# Altium project FluidGuard(Rx).PrjPcb (part 2 of 3)

## Sheet PowerSwitch.SchDoc: POWER BLOCK
size A4; SheetNumber: 5; SheetTotal: 7; DOC_NO_SCH_DWG: #022024031504
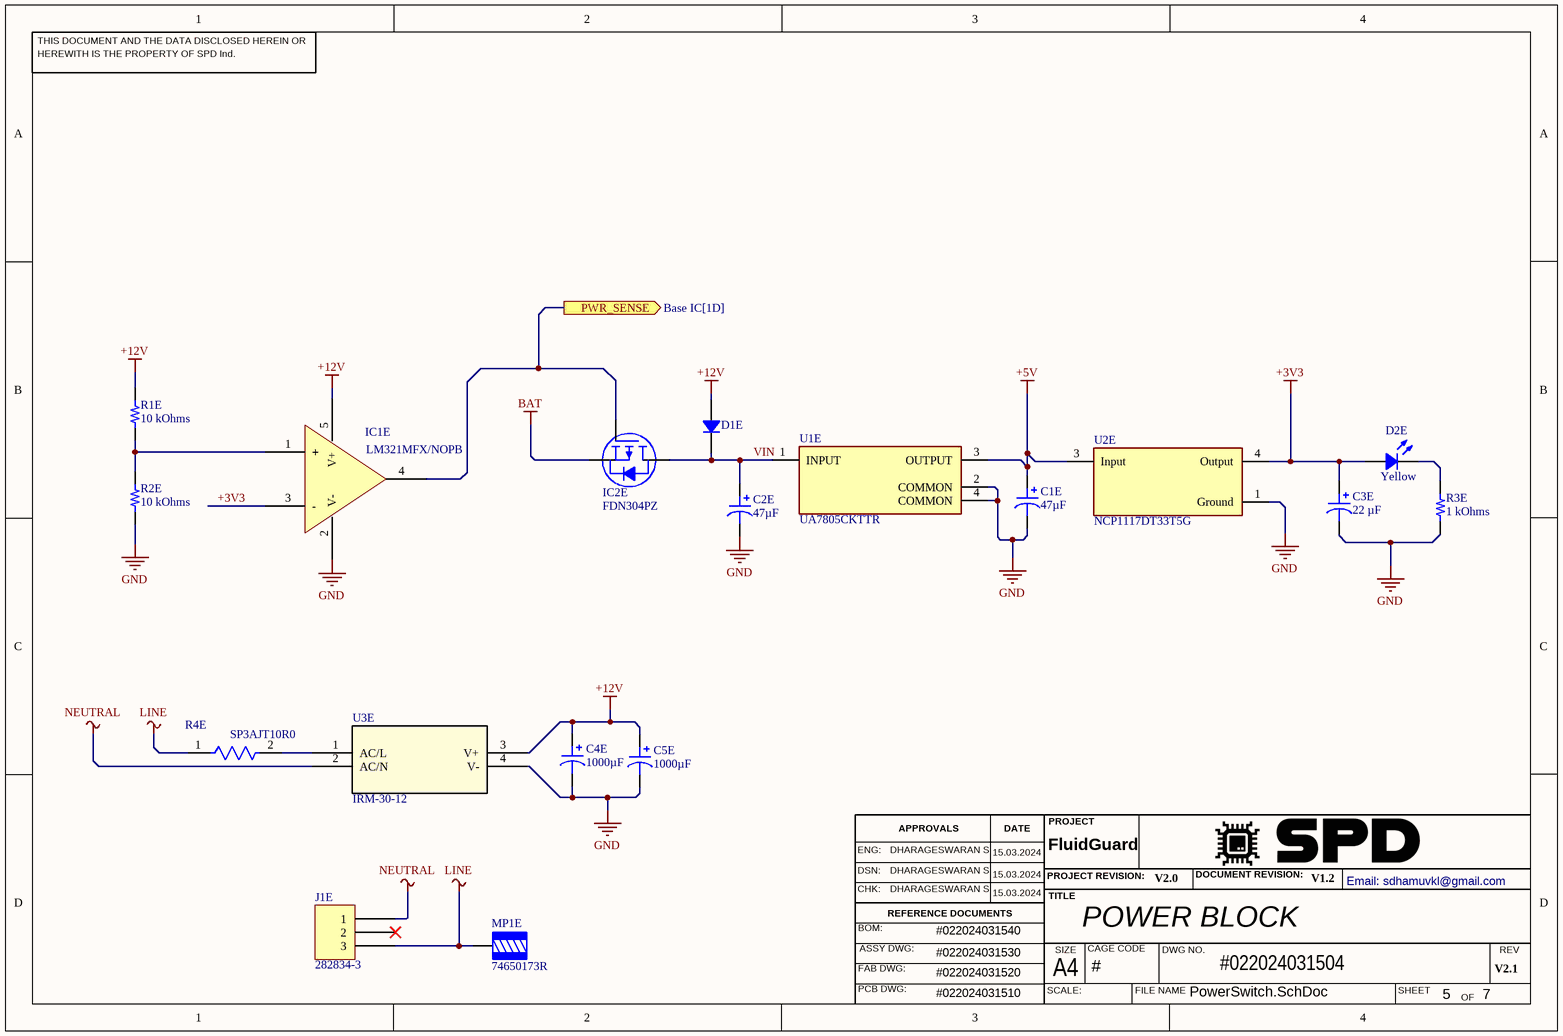
[diagram p3: PowerSwitch.SchDoc]

### Parts
C1E  47µF  [CAP ALSMD 6.6MM H5.4MM]
C2E  47µF  [CAP ALSMD 6.6MM H5.4MM]
C3E  22 µF  [CAP POL 2917_7343]
C4E  1000µF  [CAP TH ALUM ELEC D10.00mm S5.00mm H14.00mm]
C5E  1000µF  [CAP TH ALUM ELEC D10.00mm S5.00mm H14.00mm]
D1E  ES2A-13-F  [DO214AA SMB]  (value not drawn)
D2E  Yellow  [LED 0402_1005 YELLOW]
IC1E  LM321MFX/NOPB  [TI SOT-23-5 DBV]
IC2E  FDN304PZ  [ON SEMI SOT-23-3]
J1E  282834-3  [TE 282834-3]
MP1E  74650173R  [WURTH 74650173]
R1E  10 kOhms  [RES 0402_1005]
R2E  10 kOhms  [RES 0402_1005]
R3E  1 kOhms  [RES 0402_1005]
R4E  SP3AJT10R0  [FP-SP3A-MFG]
U1E  UA7805CKTTR  [FP-KTT0003A-MFG]
U2E  NCP1117DT33T5G  [FP-369C-MFG]
U3E  IRM-30-12  [IRM-30_MWU]

### Ports
PWR_SENSE (out, see Base IC[1D])

### Nets
+3V3: C3E.1 D2E.1 IC1E.3(-) U2E.4(Output)
+5V: C1E.1 U1E.3(OUTPUT) U2E.3(Input)
+12V: C4E.1 C5E.1 D1E.1 IC1E.5(V+) R1E.2 U3E.3(V+)
BAT: IC2E.2(S)
GND: C1E.2 C2E.2 C3E.2 C4E.2 C5E.2 IC1E.2(V-) R2E.1 R3E.1 U1E.2(COMMON) U1E.4(COMMON) U2E.1(Ground) U3E.4(V-)
LINE: J1E.3 MP1E.1 R4E.1
NEUTRAL: J1E.1 U3E.2(AC/N)
VIN: C2E.1 D1E.2 IC2E.3(D) U1E.1(INPUT)
NetD2E_2: D2E.2 R3E.2
NetIC1E_1: IC1E.1(+) R1E.1 R2E.2
NetIC1E_4: IC1E.4(OUT) IC2E.1(G) ; port PWR_SENSE
NetR4E_2: R4E.2 U3E.1(AC/L)

Not connected (* = marked no-connect by the designer): J1E 2*

### Notes on the sheet
- THIS DOCUMENT AND THE DATA DISCLOSED HEREIN OR
- HEREWITH IS THE PROPERTY OF SPD Ind.
- ENG:
- DHARAGESWARAN S
- APPROVALS
- DATE
- PROJECT
- DSN:
- CHK:
- REFERENCE DOCUMENTS
- PROJECT REVISION:
- TITLE
- DOCUMENT REVISION:
- Email: sdhamuvkl@gmail.com <https://github.com/DhamuVkl>
- BOM:
- FAB DWG:
- PCB DWG:
- ASSY DWG:
- SCALE:
- A4
- SIZE
- CAGE CODE
- FILE NAME
- DWG NO.
- SHEET
- REV
- OF

### Library data of the parts
C1E C2E = EEE-HA1C470P: CAP ALUM 47UF 20% 16V SMD; Manufacturer: Panasonic Electronic Components; id: 1065; Ripple Current @ Low Frequency: 70mA @ 120Hz; Surface Mount Land Size: 0.260" L x 0.260" W (6.60mm x 6.60mm); Polarization: Polar; Lifetime @ Temp.: 1000 Hrs @ 105°C; Ripple Current @ High Frequency: 119mA @ 10kHz; Part Number: EEE-HA1C470P; Value: 47µF; Height - Seated (Max): 0.213" (5.40mm); Supplier Part Number 1: PCE4189CT-ND; ComponentLink2Description: DigiKey Link; ComponentLink1URL: https://industrial.panasonic.com/cdbs/www-data/pdf/RDE0000/ABA0000C1151.pdf; PartId: 8737; Tolerance: ±20%; Supplier 1: DigiKey; Series: HA; LastUpdated: 2020-09-02T01:18:32.593; Part Status: Active; Capacitance: 47µF; Device Package: Radial, Can - SMD; Ratings: AEC-Q200; Voltage - Rated: 16V; Minimum Order: 1; Packaging: TapeAndReel; Applications: Automotive; Package / Case: Radial, Can - SMD; ComponentLink1Description: Datasheet; Price: 0.08; ComponentLink2URL: http://digikey.com/product-detail/en/panasonic-electronic-components/EEE-HA1C470P/PCE4189CT-ND/814262; Lifecycle Status: Active; Operating Temperature: -40°C ~ 105°C; Size / Dimension: 0.248" Dia (6.30mm); Mounting Type: Surface Mount
C3E = T491D226K010AT: CAP TANT 22UF 10% 10V 2917; Manufacturer: KEMET; Manufacturer Size Code: D; id: 3007; Type: Molded; Lifetime @ Temp.: 2000 Hrs @ 125°C; Esr (Equivalent Series Resistance): 1.6Ohm; Part Number: T491D226K010AT; Value: 22 µF; Height - Seated (Max): 0.122" (3.10mm); Supplier Part Number 1: 399-5599-1-ND; ComponentLink2Description: DigiKey Link; Features: General Purpose; ComponentLink1URL: https://api.kemet.com/component-edge/download/datasheet/T491D226K010AT.pdf; PartId: 3007; Tolerance: ±10%; Supplier 1: DigiKey; Series: T491; LastUpdated: 2023-01-02T20:46:27.020; Part Status: Active; Capacitance: 22 µF; Device Package: 2917 (7343 Metric); Voltage - Rated: 10 V; Minimum Order: 1; Packaging: TapeAndReel; Package / Case: 2917 (7343 Metric); ComponentLink1Description: Datasheet; Price: 0.31; ComponentLink2URL: https://www.digikey.com/en/products/detail/kemet/T491D226K010AT/2039625; Lifecycle Status: Active; Operating Temperature: -55°C ~ 125°C; Size / Dimension: 0.287" L x 0.169" W (7.30mm x 4.30mm); Mounting Type: Surface Mount
C4E C5E = 860020375017: CAP ALUM 1000UF 20% 16V RADIAL; Manufacturer: Würth Elektronik; id: 1938; Ripple Current @ Low Frequency: 540mA @ 120Hz; Polarization: Polar; Lifetime @ Temp.: 2000 Hrs @ 105°C; Ripple Current @ High Frequency: 745.2mA @ 100kHz; Part Number: 860020375017; Value: 1000µF; Height - Seated (Max): 0.551" (14.00mm); Supplier Part Number 1: 732-8804-1-ND; ComponentLink2Description: DigiKey Link; ComponentLink1URL: https://katalog.we-online.de/pbs/datasheet/860020375017.pdf; PartId: 11161; Tolerance: ±20%; Supplier 1: DigiKey; Series: WCAP-ATG5; LastUpdated: 2020-09-02T01:31:11.520; Part Status: Active; Capacitance: 1000µF; Device Package: Radial, Can; Voltage - Rated: 16V; Lead Spacing: 0.197" (5.00mm); Minimum Order: 1; Packaging: TapeAndBox; Applications: General Purpose; Package / Case: Radial, Can; ComponentLink1Description: Datasheet; Price: 0.24; ComponentLink2URL: http://digikey.com/product-detail/en/w-rth-elektronik/860020375017/732-8804-1-ND/5728749; Lifecycle Status: Active; Operating Temperature: -40°C ~ 105°C; Size / Dimension: 0.394" Dia (10.00mm); Mounting Type: Through Hole
D1E = ES2A-13-F: DIODE GEN PURP 50V 2A SMB; Manufacturer: Diodes Incorporated; id: 319; Reverse Recovery Time (Trr): 25 ns; Capacitance @ Vr, F: 25pF @ 4V, 1MHz; Speed: Fast Recovery =< 500ns, > 200mA (Io); Voltage - Forward (Vf) (Max) @ If: 920 mV @ 2 A; Diode Type: Standard; Current - Reverse Leakage @ Vr: 5 µA @ 50 V; Part Number: ES2A-13-F; Supplier Part Number 1: ES2A-FDICT-ND; Supplier Device Package: SMB; ComponentLink1Description: Datasheet; ComponentLink2URL: https://www.digikey.com/en/products/detail/diodes-incorporated/ES2A-13-F/815105; ComponentLink1URL: https://www.diodes.com/assets/Datasheets/ds14002.pdf; Supplier 1: DigiKey; Series: -; Part Status: Active; ComponentLink2Description: DigiKey Link; Current - Average Rectified (Io): 2A; Operating Temperature - Junction: -55°C ~ 150°C; Packaging: TapeAndReel; Minimum Order: 1; Voltage - DC Reverse (Vr) (Max): 50 V; Package / Case: DO-214AA, SMB; PartId: 319; Lifecycle Status: Active; LastUpdated: 2023-01-02T20:53:06.797; Mounting Type: Surface Mount; Price: 0.22
D2E = SM0402YC: LED YELLOW CLEAR 0402 SMD; Manufacturer: Bivar Inc.; id: 170; Lens Color: Colorless; Wavelength - Peak: 593nm; Lens Style: Rectangle with Flat Top; Viewing Angle: 130°; Lens Size: 0.50mm x 1.00mm; Configuration: 0402; Wavelength - Dominant: 592nm; Voltage - Forward (Vf) (Typ): 2V; Current - Test: 20mA; Millicandela Rating: 145mcd; Part Number: SM0402YC; Supplier Part Number 1: 492-2206-1-ND; Lens Transparency: Clear; Supplier Device Package: 0402; ComponentLink1Description: Datasheet; Color: Yellow; ComponentLink2URL: https://www.digikey.com/en/products/detail/bivar-inc/SM0402YC/6810862; ComponentLink1URL: https://www.bivar.com/Files/Datasheets/SM0402YC.pdf; Supplier 1: DigiKey; Series: -; Height (Max): 0.71mm; Part Status: Active; ComponentLink2Description: DigiKey Link; Device Package: 0402 (1005 Metric); Packaging: TapeAndReel; Minimum Order: 1; Package / Case: 0402 (1005 Metric); PartId: 170; Lifecycle Status: Active; LastUpdated: 2023-01-02T20:57:30.187; Value: Yellow; Size / Dimension: 1.00mm L x 0.50mm W; Mounting Type: Surface Mount; Price: 0.16
IC1E = LM321MFX/NOPB: IC OPAMP GP 1 CIRCUIT SOT23-5; Manufacturer: Texas Instruments; id: 11; Voltage - Input Offset: 2mV; Slew Rate: 0.4V/µs; Number Of Circuits: 1; Current - Input Bias: 45nA; Gain Bandwidth Product: 1MHz; Amplifier Type: General Purpose; Current - Supply: 660µA; Voltage - Supply, Single/Dual (±): 3V ~ 30V, ±1.5V ~ 15V; Current - Output / Channel: 40mA; Part Number: LM321MFX/NOPB; Supplier Part Number 1: LM321MFX/NOPBCT-ND; Supplier Device Package: SOT-23-5; ComponentLink1Description: Datasheet; ComponentLink2URL: http://digikey.com/product-detail/en/texas-instruments/LM321MFX-NOPB/LM321MFX-NOPBCT-ND/3440175; ComponentLink1URL: http://www.ti.com/general/docs/suppproductinfo.tsp?distId=10&gotoUrl=http%3A%2F%2Fwww.ti.com%2Flit%2Fgpn%2Flm321; Supplier 1: DigiKey; Series: -; Part Status: Active; ComponentLink2Description: DigiKey Link; Device Package: SC-74A, SOT-753; Packaging: TapeAndReel; Minimum Order: 1; Package / Case: SC-74A, SOT-753; PartId: 11; Lifecycle Status: Active; LastUpdated: 2020-03-30T15:10:58.873; Operating Temperature: -40°C ~ 85°C; Mounting Type: Surface Mount; Price: 0.23
IC2E = FDN304PZ: MOSFET P-CH 20V 2.4A SSOT-3; Manufacturer: ON Semiconductor; id: 80; FET Type: P-Channel; Drive Voltage (Max Rds On,  Min Rds On): 1.8V, 4.5V; Power Dissipation (Max): 500mW (Ta); Vgs (Max): ±8V; Input Capacitance (Ciss) (Max) @ Vds: 1310pF @ 10V; Gate Charge (Qg) (Max) @ Vgs: 20nC @ 4.5V; Current - Continuous Drain (Id) @ 25°C: 2.4A (Ta); Rds On (Max) @ Id, Vgs: 52mOhm @ 2.4A, 4.5V; Vgs(Th) (Max) @ Id: 1.5V @ 250µA; Part Number: FDN304PZ; Supplier Part Number 1: FDN304PZCT-ND; Supplier Device Package: SuperSOT-3; ComponentLink1Description: Datasheet; ComponentLink2URL: http://digikey.com/product-detail/en/on-semiconductor/FDN304PZ/FDN304PZCT-ND/1849909; ComponentLink1URL: https://www.onsemi.com/pub/Collateral/FDN304PZ-D.pdf; Supplier 1: DigiKey; Series: PowerTrench®; Part Status: Active; ComponentLink2Description: DigiKey Link; Packaging: TapeAndReel; Minimum Order: 1; Drain To Source Voltage (Vdss): 20V; Package / Case: TO-236-3, SC-59, SOT-23-3; Lifecycle Status: Active; LastUpdated: 2023-01-02T21:05:00.863; Technology: MOSFET (Metal Oxide); Operating Temperature: -55°C ~ 150°C (TJ); Mounting Type: Surface Mount; Price: 0.18
J1E = 282834-3: TERM BLK 3P SIDE ENT 2.54MM PCB; Manufacturer: TE Connectivity AMP Connectors; id: 2; Wire Gauge: 16-30 AWG; Voltage: 150V; Positions Per Level: 3; Number Of Levels: 1; Pitch: 0.100" (2.54mm); Mating Orientation: Horizontal with Board; Wire Termination: Screw - Rising Cage Clamp; Current: 10A; Part Number: 282834-3; Supplier Part Number 1: A98334-ND; ComponentLink1Description: Datasheet; Color: Green; ComponentLink2URL: http://digikey.com/product-detail/en/te-connectivity-amp-connectors/282834-3/A98334-ND/1153264; ComponentLink1URL: https://www.te.com/commerce/DocumentDelivery/DDEController?Action=srchrtrv&DocNm=282834&DocType=Customer+Drawing&DocLang=English; Supplier 1: DigiKey; Series: Buchanan; Part Status: Active; ComponentLink2Description: DigiKey Link; Packaging: Bulk; Minimum Order: 1; Lifecycle Status: Active; LastUpdated: 2020-01-15T04:15:50.317; Mounting Type: Through Hole; Price: 2.01
MP1E = 74650173R: TERM REDCUBE M3 4PIN PCB; Manufacturer: Würth Elektronik; id: 4; Current Rating (Amps): 50 A; Part Number: 74650173R; Supplier Part Number 1: 732-10885-1-ND; Termination: Solder; Screw Size: M3; ComponentLink1Description: Datasheet; ComponentLink2URL: https://www.digikey.com/en/products/detail/würth-elektronik/74650173R/6643981; Features: Screw not Included; ComponentLink1URL: https://katalog.we-online.de/em/datasheet/74650173R.pdf; Supplier 1: DigiKey; Series: REDCUBE WP-THRBU; Part Status: Active; ComponentLink2Description: DigiKey Link; Number Of Pins: 4; Packaging: TapeAndReel; Minimum Order: 1; Lifecycle Status: Active; LastUpdated: 2022-08-07T20:42:53.530; Terminal Type: Screw Terminal, Power Tap; Mounting Type: Through Hole; Price: 2.63
R1E R2E = AA0402FR-0710KL: RES SMD 10K OHM 1% 1/16W 0402; Manufacturer: Yageo; id: 10610; Temperature Coefficient: ±150ppm/°C; Power (Watts): 0.063W, 1/16W; Part Number: AA0402FR-0710KL; Height - Seated (Max): 0.015" (0.37mm); Supplier Part Number 1: 13-AA0402FR-0710KLCT-ND; Supplier Device Package: 0402; ComponentLink1Description: Datasheet; ComponentLink2URL: https://www.digikey.com/en/products/detail/yageo/AA0402FR-0710KL/5887729; Features: Anti-Sulfur, Automotive AEC-Q200, Moisture Resistant; ComponentLink1URL: https://www.yageo.com/upload/media/product/productsearch/datasheet/rchip/PYu-AA_51_RoHS_L_3.pdf; Composition: Thick Film; Tolerance: ±1%; Supplier 1: DigiKey; Series: AA; Part Status: Active; ComponentLink2Description: DigiKey Link; Device Package: 0402 (1005 Metric); Packaging: TapeAndReel; Ratings: AEC-Q200; Minimum Order: 1; Package / Case: 0402 (1005 Metric); PartId: 59190; Lifecycle Status: Active; LastUpdated: 2023-01-02T20:20:10.303; Operating Temperature: -55°C ~ 155°C; Number Of Terminations: 2; Value: 10 kOhms; Size / Dimension: 0.039" L x 0.020" W (1.00mm x 0.50mm); Price: 0.01; Resistance: 10 kOhms
R3E = AA0402FR-071KL: RES SMD 1K OHM 1% 1/16W 0402; Manufacturer: Yageo; id: 10598; Temperature Coefficient: ±150ppm/°C; Power (Watts): 0.063W, 1/16W; Part Number: AA0402FR-071KL; Height - Seated (Max): 0.015" (0.37mm); Supplier Part Number 1: 13-AA0402FR-071KLCT-ND; Supplier Device Package: 0402; ComponentLink1Description: Datasheet; ComponentLink2URL: https://www.digikey.com/en/products/detail/yageo/AA0402FR-071KL/5887878; Features: Anti-Sulfur, Automotive AEC-Q200, Moisture Resistant; ComponentLink1URL: https://www.yageo.com/upload/media/product/productsearch/datasheet/rchip/PYu-AA_51_RoHS_L_3.pdf; Composition: Thick Film; Tolerance: ±1%; Supplier 1: DigiKey; Series: AA; Part Status: Active; ComponentLink2Description: DigiKey Link; Device Package: 0402 (1005 Metric); Packaging: TapeAndReel; Ratings: AEC-Q200; Minimum Order: 1; Package / Case: 0402 (1005 Metric); PartId: 59178; Lifecycle Status: Active; LastUpdated: 2023-01-02T20:20:10.210; Operating Temperature: -55°C ~ 155°C; Number Of Terminations: 2; Value: 1 kOhms; Size / Dimension: 0.039" L x 0.020" W (1.00mm x 0.50mm); Price: 0.01; Resistance: 1 kOhms
R4E = CMP-26528-000004-1: RES 10 OHM 5% 4W AXIAL; Resistance: 10R; Temperature Coefficient: 20ppm/°C; Power Rating: 4W; Series: SP; Mount: Through Hole; Diameter: 5.5mm; RoHS Compliant: Yes; Length: 12.7mm; Max Operating Temperature: 350°C; Max Power Dissipation: 4W; Number of Terminations: 2; Resistor Type: Wirewound; Min Operating Temperature: -55°C; Case/Package: Axial; Tolerance: 5%; Package Quantity: 1; Packaging: Cut Tape
U1E = CMP-1685-00014-2: IC REG LIN 5V 1.5A DDPAK/TO263-3; Output Type: Fixed; Quiescent Current: 8mA; Dropout Voltage: 2V; Max Input Voltage: 25V; Number of Regulators: 1; Max Output Voltage: 5.2V; Polarity: Positive; Min Output Voltage: 4.8V; Power Supply Rejection Ratio (PSRR): 78dB; Min Input Voltage: 7V; Power Rating: 15W; Number of Pins: 3; Output Voltage: 5V; Max Output Current: 1.5A; Nominal Output Voltage: 5V; Case/Package: TO-263; Width: 9.65mm; REACH SVHC: No SVHC; Max Operating Temperature: 125°C; Output Current: 1.5A; Weight: 0.050897oz; Contact Plating: Tin; Packaging: Tape and Reel; Mount: Surface Mount; Radiation Hardening: No; Lead Free: Lead Free; Min Operating Temperature: 0°C; Length: 10.67mm; Package Quantity: 1; Number of Outputs: 1; Height: 4.83mm
U2E = CMP-07128-000023-2: IC REG LINEAR 3.3V 1A DPAK; Polarity: Positive; Input Bias Current: 6mA; Quiescent Current: 10mA; Output Type: Fixed; Number of Outputs: 1; Output Voltage Accuracy: 1%; Max Input Voltage: 20V; Dropout Voltage: 1.07V; Reference Voltage: 1.27V; Lead Free: Lead Free; Width: 6.22mm; Min Current Limit: 1A; Case/Package: DPAK; Output Voltage: 3.3V; Halogen Free: Halogen Free; Radiation Hardening: No; Min Operating Temperature: 0°C; Nominal Output Voltage: 3.3V; Output Current: 1A; Package Quantity: 1; Max Operating Temperature: 125°C; Max Output Current: 1A; Number of Regulators: 1; REACH SVHC: No SVHC; Packaging: Tape and Reel; Number of Pins: 3; Height: 2.38mm; Length: 6.73mm; Mount: Surface Mount; Contact Plating: Tin; Accuracy: 1%
U3E = IRM-30-12: No Description Available; Mfr_Name: Mean Well; RefDes: RefDes; Type: Type; Supplier 1: Future Electronics; Supplier Part Number 1: 9051654

## Sheet Debug.SchDoc: DEBUG PORTS
size A4; SheetNumber: 7; SheetTotal: 7; DOC_NO_SCH_DWG: #022024031506
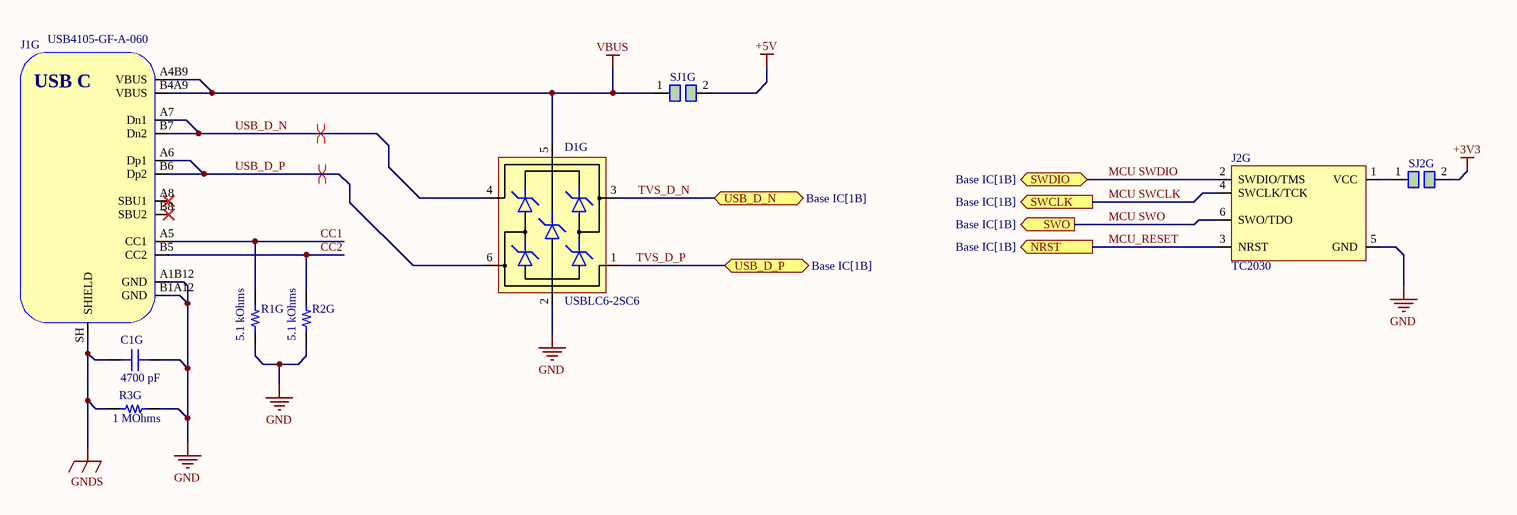
[diagram p4: Debug.SchDoc]

### Parts
C1G  4700 pF  [CAP 0402_1005]
D1G  USBLC6-2SC6  [SOT-23-6]
J1G  USB4105-GF-A-060  [USB4105-GF-A-060]
J2G  TC2030  [TC2030-FP]  (no BOM)
R1G  5.1 kOhms  [RES 0402_1005]
R2G  5.1 kOhms  [RES 0402_1005]
R3G  1 MOhms  [RES 0402_1005]
SJ1G  2PIN  [Rectangular Jumper]  (value not drawn)
SJ2G  2PIN  [Rectangular Jumper]  (value not drawn)

### Ports
NRST (out, see Base IC[1B]), SWCLK (out, see Base IC[1B]), SWDIO (bidir, see Base IC[1B]), SWO (out, see Base IC[1B]), USB_D_N (bidir, see Base IC[1B]), USB_D_P (bidir, see Base IC[1B])

### Nets
+3V3: SJ2G.2
+5V: SJ1G.2
GND: C1G.2 D1G.2(GND) J1G.A1B12(GND) J1G.B1A12(GND) J2G.5(GND) R1G.1 R2G.1 R3G.2
GNDS: C1G.1 J1G.SH(SHIELD) R3G.1
VBUS: D1G.5(VBUS) J1G.A4B9(VBUS) J1G.B4A9(VBUS) SJ1G.1
CC1: J1G.A5(CC1) R1G.2
CC2: J1G.B5(CC2) R2G.2
MCU SWCLK: J2G.4(SWCLK/TCK) ; port SWCLK
MCU SWDIO: J2G.2(SWDIO/TMS) ; port SWDIO
MCU SWO: J2G.6(SWO/TDO) ; port SWO
MCU_RESET: J2G.3(NRST) ; port NRST
TVS_D_N: D1G.3(IO2) ; port USB_D_N
TVS_D_P: D1G.1(IO1) ; port USB_D_P
USB_D_N: D1G.4(IO2) J1G.A7(Dn1) J1G.B7(Dn2)
USB_D_P: D1G.6(IO1) J1G.A6(Dp1) J1G.B6(Dp2)
NetJ2G_1: J2G.1(VCC) SJ2G.1

Not connected (* = marked no-connect by the designer): J1G A8(SBU1)* B8(SBU2)*

### Layout directives
differential pair: USB_D_N, USB_D_P

### Notes on the sheet
- THIS DOCUMENT AND THE DATA DISCLOSED HEREIN OR
- HEREWITH IS THE PROPERTY OF SPD Ind.
- ENG:
- DHARAGESWARAN S
- APPROVALS
- DATE
- PROJECT
- DSN:
- CHK:
- REFERENCE DOCUMENTS
- PROJECT REVISION:
- TITLE
- DOCUMENT REVISION:
- Email: sdhamuvkl@gmail.com <https://github.com/DhamuVkl>
- BOM:
- FAB DWG:
- PCB DWG:
- ASSY DWG:
- SCALE:
- A4
- SIZE
- CAGE CODE
- FILE NAME
- DWG NO.
- SHEET
- REV
- OF
- (in symbol USB4105-GF-A-060) USB C

### Library data of the parts
C1G = C0402C472K4RECAUTO: CAP CER 0402 4.7NF 16V X7R 10%; Manufacturer: KEMET; id: 3032; Part Number: C0402C472K4RECAUTO; Value: 4700 pF; Temperature Coefficient: X7R; Supplier Part Number 1: 399-17875-1-ND; ComponentLink2Description: DigiKey Link; ComponentLink1URL: https://api.kemet.com/component-edge/download/datasheet/C0402C472K4RECAUTO.pdf; PartId: 12122; Tolerance: ±10%; Supplier 1: DigiKey; Series: ESD SMD Auto X7R; LastUpdated: 2023-01-03T20:03:46.940; Part Status: Active; Capacitance: 4700 pF; Device Package: 0402 (1005 Metric); Ratings: AEC-Q200; Thickness (Max): 0.022" (0.55mm); Voltage - Rated: 16V; Minimum Order: 1; Packaging: TapeAndReel; Applications: Automotive, ESD Protection; Package / Case: 0402 (1005 Metric); ComponentLink1Description: Datasheet; Price: 0.01; ComponentLink2URL: https://www.digikey.com/en/products/detail/kemet/C0402C472K4RECAUTO/8640469; Lifecycle Status: Active; Operating Temperature: -55°C ~ 125°C; Size / Dimension: 0.039" L x 0.020" W (1.00mm x 0.50mm); Mounting Type: Surface Mount, MLCC
D1G = USBLC6-2SC6: Low-Capacitance ESD Protection USB; Manufacturer: STMicroelectronics; Manufacturer Part Number: USBLC6-2SC6; Distributor Link: https://www.mouser.de/ProductDetail/STMicroelectronics/USBLC6-2SC6?qs=po45yt2pPpu%2FhNIlwQdTlg%3D%3D
J1G = USB4105-GF-A-060: USB Connector Type C SMT 12 Pin; Manufacturer: GCT; Manufacturer Part Number: USB4105-GF-A-060; Distributor Link: https://eu.mouser.com/ProductDetail/GCT/USB4105-GF-A-060?qs=QNEnbhJQKvY2mocwNJzgfA%3D%3D
J2G = TC2030: Tag-Connect No-Solder SWD Debug Connector DO NOT PLACE; Manufacturer: Tag-Connect; Manufacturer Part Number: TC2030; Supplier 1: Digikey; Supplier Part Number 1: TC2030-MCP-NLTC-ND
R1G R2G = AC0402FR-075K1L: RES SMD 5.1K OHM 1% 1/16W 0402; Manufacturer: Yageo; id: 5028; Temperature Coefficient: ±100ppm/°C; Power (Watts): 0.063W, 1/16W; Part Number: AC0402FR-075K1L; Height - Seated (Max): 0.015" (0.37mm); Supplier Part Number 1: YAG3503CT-ND; Supplier Device Package: 0402; ComponentLink1Description: Datasheet; ComponentLink2URL: https://www.digikey.com/en/products/detail/yageo/AC0402FR-075K1L/5895438; Features: Automotive AEC-Q200, Moisture Resistant; ComponentLink1URL: https://www.yageo.com/upload/media/product/productsearch/datasheet/rchip/PYu-AC_51_RoHS_L_7.pdf; Composition: Thick Film; Tolerance: ±1%; Supplier 1: DigiKey; Series: AC; Part Status: Active; ComponentLink2Description: DigiKey Link; Device Package: 0402 (1005 Metric); Packaging: CutTape; Ratings: AEC-Q200; Minimum Order: 1; Package / Case: 0402 (1005 Metric); PartId: 12111; Lifecycle Status: Active; LastUpdated: 2023-01-02T20:21:09.567; Operating Temperature: -55°C ~ 155°C; Number Of Terminations: 2; Value: 5.1 kOhms; Size / Dimension: 0.039" L x 0.020" W (1.00mm x 0.50mm); Price: 0.01; Resistance: 5.1 kOhms
R3G = AC0402FR-071ML: RES SMD 1M OHM 1% 1/16W 0402; Manufacturer: Yageo; id: 4991; Temperature Coefficient: ±100ppm/°C; Power (Watts): 0.063W, 1/16W; Part Number: AC0402FR-071ML; Height - Seated (Max): 0.015" (0.37mm); Supplier Part Number 1: YAG3450CT-ND; Supplier Device Package: 0402; ComponentLink1Description: Datasheet; ComponentLink2URL: https://www.digikey.com/en/products/detail/yageo/AC0402FR-071ML/5895164; Features: Automotive AEC-Q200, Moisture Resistant; ComponentLink1URL: https://www.yageo.com/upload/media/product/productsearch/datasheet/rchip/PYu-AC_51_RoHS_L_7.pdf; Composition: Thick Film; Tolerance: ±1%; Supplier 1: DigiKey; Series: AC; Part Status: Active; ComponentLink2Description: DigiKey Link; Device Package: 0402 (1005 Metric); Packaging: CutTape; Ratings: AEC-Q200; Minimum Order: 1; Package / Case: 0402 (1005 Metric); PartId: 12043; Lifecycle Status: Active; LastUpdated: 2023-01-02T20:21:09.883; Operating Temperature: -55°C ~ 155°C; Number Of Terminations: 2; Value: 1 MOhms; Size / Dimension: 0.039" L x 0.020" W (1.00mm x 0.50mm); Price: 0.01; Resistance: 1 MOhms
SJ1G SJ2G = Regtangular Jumper

## Sheet BMS.SchDoc: BMS BLOCK
size A4; SheetNumber: 4; SheetTotal: 7; DOC_NO_SCH_DWG: #022024031503
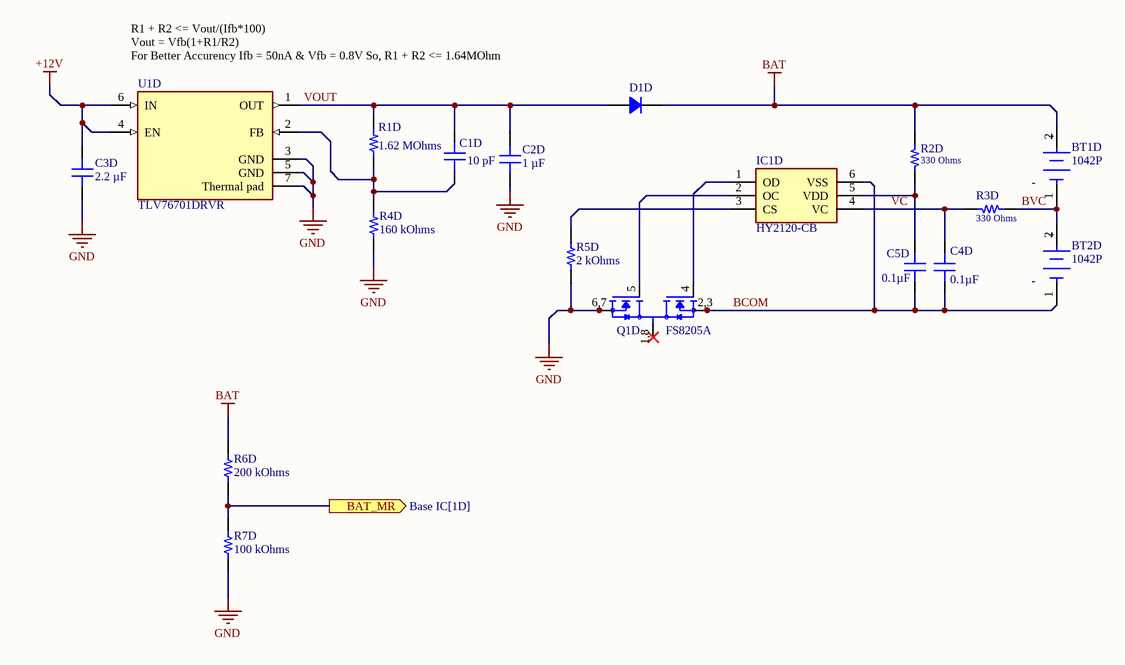
[diagram p5: BMS.SchDoc]

### Parts
BT1D  1042P  [FP-1042P-MFG]
BT2D  1042P  [FP-1042P-MFG]
C1D  10 pF  [CAP 0603_1608]
C2D  1 µF  [CAP 0603_1608]
C3D  2.2 µF  [CAP 0603_1608]
C4D  0.1µF  [CAP 0603_1608]
C5D  0.1µF  [CAP 0603_1608]
D1D  RS1AB-13-F  [DO214AA SMB]  (value not drawn)
IC1D  HY2120-CB  [SOT95P280X140-6N]
Q1D  FS8205A  [SOP65P640X120-8N]
R1D  1.62 MOhms  [RES 0603_1608]
R2D  330 Ohms  [RES 0603_1608]
R3D  330 Ohms  [RES 0603_1608]
R4D  160 kOhms  [RES 0603_1608]
R5D  2 kOhms  [RES 0603_1608]
R6D  200 kOhms  [RES 1206_3216]
R7D  100 kOhms  [RES 1206_3216]
U1D  TLV76701DRVR  [FP-DRV0006A-IPC_C]

### Ports
BAT_MR (out, see Base IC[1D])

### Nets
+12V: C3D.2 U1D.4(EN) U1D.6(IN)
BAT: BT1D.2(A) D1D.2 R2D.1 R6D.2
GND: C2D.1 C3D.1 Q1D.6(S2) Q1D.6,7(S2) R4D.1 R5D.1 R7D.1 U1D.3(GND) U1D.5(GND) U1D.7(Thermal_pad)
BCOM: BT2D.1(C) C4D.1 C5D.1 IC1D.6(VSS) Q1D.2(S1) Q1D.2,3(S1)
BVC: BT1D.1(C) BT2D.2(A) R3D.1
VC: C4D.2 IC1D.4(VC) R3D.2
VOUT: C1D.2 C2D.2 D1D.1 R1D.2 U1D.1(OUT)
NetC1D_1: C1D.1 R1D.1 R4D.2 U1D.2(FB)
NetC5D_2: C5D.2 IC1D.5(VDD) R2D.2
NetIC1D_1: IC1D.1(OD) Q1D.4(G1)
NetIC1D_2: IC1D.2(OC) Q1D.5(G2)
NetIC1D_3: IC1D.3(CS) R5D.2
NetQ1D_1: Q1D.1(D12) Q1D.1,8(D12)
NetR6D_1: R6D.1 R7D.2 ; port BAT_MR

### Notes on the sheet
- (near U1D) R1 + R2 <= Vout/(Ifb*100)
  Vout = Vfb(1+R1/R2)
  For Better Accurency Ifb = 50nA & Vfb = 0.8V So, R1 + R2 <= 1.64MOhm
- THIS DOCUMENT AND THE DATA DISCLOSED HEREIN OR
- HEREWITH IS THE PROPERTY OF SPD Ind.
- ENG:
- DHARAGESWARAN S
- APPROVALS
- DATE
- PROJECT
- DSN:
- CHK:
- REFERENCE DOCUMENTS
- PROJECT REVISION:
- TITLE
- DOCUMENT REVISION:
- Email: sdhamuvkl@gmail.com <https://github.com/DhamuVkl>
- BOM:
- FAB DWG:
- PCB DWG:
- ASSY DWG:
- SCALE:
- A4
- SIZE
- CAGE CODE
- FILE NAME
- DWG NO.
- SHEET
- REV
- OF
- (in symbol CMP-19636-000019-1) +; -

### Library data of the parts
BT1D BT2D = CMP-19636-000019-1: BATTERY HOLDER 18650 SMD TAB; Number of Cells: 1; Max Operating Temperature: 145°C; Termination: SMD/SMT; Mount: Surface Mount; Min Operating Temperature: -50°C; Package Quantity: 200; Packaging: Tray; Lead Free: Lead Free
C1D = 885012006017: CAP CER 10PF 16V C0G/NP0 0603; Manufacturer: Würth Elektronik; id: 4142; Temperature Coefficient: C0G, NP0; Tolerance: ±5%; Part Number: 885012006017; Value: 10 pF; Supplier Part Number 1: 732-7760-1-ND; ComponentLink2Description: DigiKey Link; ComponentLink1URL: https://katalog.we-online.de/pbs/datasheet/885012006017.pdf; PartId: 17575; Supplier 1: DigiKey; Series: WCAP-CSGP; LastUpdated: 2023-01-03T20:07:00.397; Part Status: Active; Capacitance: 10 pF; Device Package: 0603 (1608 Metric); Thickness (Max): 0.034" (0.87mm); Voltage - Rated: 16V; Minimum Order: 1; Packaging: TapeAndReel; Applications: General Purpose; Package / Case: 0603 (1608 Metric); ComponentLink1Description: Datasheet; Price: 0.02; ComponentLink2URL: https://www.digikey.com/en/products/detail/würth-elektronik/885012006017/5453615; Lifecycle Status: Active; Operating Temperature: -55°C ~ 125°C; Size / Dimension: 0.063" L x 0.031" W (1.60mm x 0.80mm); Mounting Type: Surface Mount, MLCC
C2D = CC0603ZRY5V7BB105: CAP CER 1UF 16V Y5V 0603; Manufacturer: Yageo; id: 744; Temperature Coefficient: Y5V (F); Tolerance: -20%, +80%; Part Number: CC0603ZRY5V7BB105; Value: 1 µF; Supplier Part Number 1: 311-1372-1-ND; ComponentLink2Description: DigiKey Link; ComponentLink1URL: http://www.yageo.com/documents/recent/UPY-GPHC_Y5V_6.3V-to-50V_8.pdf; PartId: 5227; Supplier 1: DigiKey; Series: CC; LastUpdated: 2023-01-03T20:07:40.173; Part Status: Active; Capacitance: 1 µF; Device Package: 0603 (1608 Metric); Thickness (Max): 0.035" (0.90mm); Voltage - Rated: 16V; Minimum Order: 1; Packaging: TapeAndReel; Applications: General Purpose; Package / Case: 0603 (1608 Metric); ComponentLink1Description: Datasheet; Price: 0.01; ComponentLink2URL: https://www.digikey.com/en/products/detail/yageo/CC0603ZRY5V7BB105/2103110; Lifecycle Status: Active; Operating Temperature: -30°C ~ 85°C; Size / Dimension: 0.063" L x 0.031" W (1.60mm x 0.80mm); Mounting Type: Surface Mount, MLCC
C3D = CC0603ZRY5V7BB225: CAP CER 2.2UF 16V Y5V 0603; Manufacturer: Yageo; id: 21; Temperature Coefficient: Y5V (F); Tolerance: -20%, +80%; Part Number: CC0603ZRY5V7BB225; Value: 2.2 µF; Supplier Part Number 1: 311-3416-1-ND; ComponentLink2Description: DigiKey Link; ComponentLink1URL: http://www.yageo.com/documents/recent/UPY-GPHC_Y5V_6.3V-to-50V_8.pdf; PartId: 2203; Supplier 1: DigiKey; Series: CC; LastUpdated: 2023-01-03T20:07:48.310; Part Status: Active; Capacitance: 2.2 µF; Device Package: 0603 (1608 Metric); Thickness (Max): 0.035" (0.90mm); Voltage - Rated: 16V; Minimum Order: 1; Packaging: TapeAndReel; Applications: General Purpose; Package / Case: 0603 (1608 Metric); ComponentLink1Description: Datasheet; Price: 0.01; ComponentLink2URL: https://www.digikey.com/en/products/detail/yageo/CC0603ZRY5V7BB225/5883851; Lifecycle Status: Active; Operating Temperature: -30°C ~ 85°C; Size / Dimension: 0.063" L x 0.031" W (1.60mm x 0.80mm); Mounting Type: Surface Mount, MLCC
C4D C5D = LD03YC104JAB2A: CAP CER 0.1UF 16V X7R 0603; Manufacturer: AVX Corporation; id: 1923; Tolerance: ±5%; Part Number: LD03YC104JAB2A; Value: 0.1µF; Temperature Coefficient: X7R; Supplier Part Number 1: 478-4928-1-ND; ComponentLink2Description: DigiKey Link; ComponentLink1URL: http://datasheets.avx.com/LD-Series.pdf; PartId: 10388; Supplier 1: DigiKey; Series: LD; LastUpdated: 2020-09-02T01:03:21.410; Part Status: Active; Capacitance: 0.1µF; Device Package: 0603 (1608 Metric); Thickness (Max): 0.035" (0.90mm); Voltage - Rated: 16V; Minimum Order: 1; Packaging: TapeAndReel; Applications: General Purpose; Package / Case: 0603 (1608 Metric); ComponentLink1Description: Datasheet; Price: 0.19; ComponentLink2URL: http://digikey.com/product-detail/en/avx-corporation/LD03YC104JAB2A/478-4928-1-ND/1858874; Lifecycle Status: Active; Operating Temperature: -55°C ~ 125°C; Size / Dimension: 0.063" L x 0.032" W (1.60mm x 0.81mm); Mounting Type: Surface Mount, MLCC
D1D = RS1AB-13-F: DIODE GEN PURP 50V 1A SMB; Manufacturer: Diodes Incorporated; id: 27; Reverse Recovery Time (Trr): 150 ns; Capacitance @ Vr, F: 15pF @ 4V, 1MHz; Speed: Fast Recovery =< 500ns, > 200mA (Io); Voltage - Forward (Vf) (Max) @ If: 1.3 V @ 1 A; Diode Type: Standard; Current - Reverse Leakage @ Vr: 5 µA @ 50 V; Part Number: RS1AB-13-F; Supplier Part Number 1: RS1AB-FDICT-ND; Supplier Device Package: SMB; ComponentLink1Description: Datasheet; ComponentLink2URL: https://www.digikey.com/en/products/detail/diodes-incorporated/RS1AB-13-F/814456; ComponentLink1URL: https://www.diodes.com/assets/Datasheets/ds15002.pdf; Supplier 1: DigiKey; Series: -; Part Status: Active; ComponentLink2Description: DigiKey Link; Current - Average Rectified (Io): 1A; Operating Temperature - Junction: -65°C ~ 150°C; Packaging: TapeAndReel; Minimum Order: 1; Voltage - DC Reverse (Vr) (Max): 50 V; Package / Case: DO-214AA, SMB; PartId: 27; Lifecycle Status: Active; LastUpdated: 2023-01-02T20:53:12.200; Mounting Type: Surface Mount; Price: 0.07
IC1D = HY2120-CB: BMS; Manufacturer_Name: Hycon; Datasheet Link: https://datasheet.lcsc.com/szlcsc/HYCON-Tech-HY2120CB_C116509.pdf; Height: 1.4mm; Manufacturer_Part_Number: HY2120-CB
Q1D = FS8205A: N/A; MF: Fortune Semiconductor; MP: FS8205A; Value: *; Availability: Not in stock; Package: Package; Price: None; SnapEDA_Link: https://www.snapeda.com/parts/FS8205A/Fortune+Semiconductor/view-part/?ref=snap; Check_prices: https://www.snapeda.com/parts/FS8205A/Fortune+Semiconductor/view-part/?ref=eda
R1D = RMCF0603FT1M62: RES 1.62M OHM 1% 1/10W 0603; Manufacturer: Stackpole Electronics Inc; id: 12536; Temperature Coefficient: ±200ppm/°C; Power (Watts): 0.1W, 1/10W; Part Number: RMCF0603FT1M62; Height - Seated (Max): 0.022" (0.55mm); Supplier Part Number 1: RMCF0603FT1M62CT-ND; Supplier Device Package: 0603; ComponentLink1Description: Datasheet; ComponentLink2URL: https://www.digikey.com/en/products/detail/stackpole-electronics-inc/RMCF0603FT1M62/1713506; Features: Automotive AEC-Q200; ComponentLink1URL: https://www.seielect.com/catalog/sei-rmcf_rmcp.pdf; Composition: Thick Film; Tolerance: ±1%; Supplier 1: DigiKey; Series: RMCF; Part Status: Active; ComponentLink2Description: DigiKey Link; Device Package: 0603 (1608 Metric); Packaging: CutTape; Ratings: AEC-Q200; Minimum Order: 1; Package / Case: 0603 (1608 Metric); PartId: 26334; Lifecycle Status: Active; LastUpdated: 2023-01-02T20:28:35.533; Operating Temperature: -55°C ~ 155°C; Number Of Terminations: 2; Value: 1.62 MOhms; Size / Dimension: 0.061" L x 0.031" W (1.55mm x 0.80mm); Price: 0.01; Resistance: 1.62 MOhms
R2D R3D = CRCW0603330RFKEAC: RES 330 OHM 1% 1/10W 0603; Manufacturer: Vishay Dale; id: 3752; Temperature Coefficient: ±100ppm/°C; Power (Watts): 0.1W, 1/10W; Part Number: CRCW0603330RFKEAC; Height - Seated (Max): 0.022" (0.55mm); Supplier Part Number 1: 541-4026-1-ND; Supplier Device Package: 0603; ComponentLink1Description: Datasheet; ComponentLink2URL: https://www.digikey.com/en/products/detail/vishay-dale/CRCW0603330RFKEAC/7928448; ComponentLink1URL: http://www.vishay.com/docs/28773/crcwce3.pdf; Composition: Thick Film; Tolerance: ±1%; Supplier 1: DigiKey; Series: CRCW-C; Part Status: Active; ComponentLink2Description: DigiKey Link; Device Package: 0603 (1608 Metric); Packaging: CutTape; Minimum Order: 1; Package / Case: 0603 (1608 Metric); PartId: 12584; Lifecycle Status: Active; LastUpdated: 2023-01-02T20:29:55.413; Operating Temperature: -55°C ~ 155°C; Number Of Terminations: 2; Value: 330 Ohms; Price: 0.01; Resistance: 330 Ohms
R4D = RMCF0603FG160K: RES 160K OHM 1% 1/10W 0603; Manufacturer: Stackpole Electronics Inc; id: 2352; Temperature Coefficient: ±100ppm/°C; Power (Watts): 0.1W, 1/10W; Part Number: RMCF0603FG160K; Height - Seated (Max): 0.022" (0.55mm); Supplier Part Number 1: 738-RMCF0603FG160KCT-ND; Supplier Device Package: 0603; ComponentLink1Description: Datasheet; ComponentLink2URL: https://www.digikey.com/en/products/detail/stackpole-electronics-inc/RMCF0603FG160K/1713653; Features: Automotive AEC-Q200; ComponentLink1URL: https://www.seielect.com/catalog/sei-rmcf_rmcp.pdf; Composition: Thick Film; Tolerance: ±1%; Supplier 1: DigiKey; Series: RMCF; Part Status: Active; ComponentLink2Description: DigiKey Link; Device Package: 0603 (1608 Metric); Packaging: CutTape; Ratings: AEC-Q200; Minimum Order: 1; Package / Case: 0603 (1608 Metric); PartId: 9704; Lifecycle Status: Active; LastUpdated: 2023-01-02T20:30:07.700; Operating Temperature: -55°C ~ 155°C; Number Of Terminations: 2; Value: 160 kOhms; Size / Dimension: 0.061" L x 0.031" W (1.55mm x 0.80mm); Price: 0.01; Resistance: 160 kOhms
R5D = RT0603BRD072KL: RES SMD 2K OHM 0.1% 1/10W 0603; Manufacturer: Yageo; id: 366; Temperature Coefficient: ±25ppm/°C; Power (Watts): 0.1W, 1/10W; Part Number: RT0603BRD072KL; Height - Seated (Max): 0.022" (0.55mm); Supplier Part Number 1: YAG1626CT-ND; Supplier Device Package: 0603; ComponentLink1Description: Datasheet; ComponentLink2URL: https://www.digikey.com/en/products/detail/yageo/RT0603BRD072KL/1072444; ComponentLink1URL: https://www.yageo.com/upload/media/product/productsearch/datasheet/rchip/PYu-RT_1-to-0.01_RoHS_L_11.pdf; Composition: Thin Film; Tolerance: ±0.1%; Supplier 1: DigiKey; Series: RT; Part Status: Active; ComponentLink2Description: DigiKey Link; Device Package: 0603 (1608 Metric); Packaging: TapeAndReel; Minimum Order: 1; Package / Case: 0603 (1608 Metric); PartId: 5635; Lifecycle Status: Active; LastUpdated: 2023-01-02T20:30:23.983; Operating Temperature: -55°C ~ 155°C; Number Of Terminations: 2; Value: 2 kOhms; Size / Dimension: 0.063" L x 0.031" W (1.60mm x 0.80mm); Price: 0.03; Resistance: 2 kOhms
R6D = ERA-8AEB204V: RES SMD 200K OHM 0.1% 1/4W 1206; Manufacturer: Panasonic Electronic Components; id: 4000; Temperature Coefficient: ±25ppm/°C; Power (Watts): 0.25W, 1/4W; Part Number: ERA-8AEB204V; Height - Seated (Max): 0.028" (0.70mm); Supplier Part Number 1: P200KBCCT-ND; Supplier Device Package: 1206; ComponentLink1Description: Datasheet; ComponentLink2URL: https://www.digikey.com/en/products/detail/panasonic-electronic-components/ERA-8AEB204V/3070868; Features: Automotive AEC-Q200; ComponentLink1URL: https://industrial.panasonic.com/cdbs/www-data/pdf/RDM0000/AOA0000C307.pdf; Composition: Thin Film; Tolerance: ±0.1%; Supplier 1: DigiKey; Series: ERA-8A; Part Status: Active; ComponentLink2Description: DigiKey Link; Device Package: 1206 (3216 Metric); Packaging: TapeAndReel; Ratings: AEC-Q200; Minimum Order: 1; Package / Case: 1206 (3216 Metric); PartId: 33994; Lifecycle Status: Active; LastUpdated: 2023-01-02T20:37:01.767; Operating Temperature: -55°C ~ 155°C; Number Of Terminations: 2; Value: 200 kOhms; Size / Dimension: 0.126" L x 0.063" W (3.20mm x 1.60mm); Price: 0.12; Resistance: 200 kOhms
R7D = RT1206BRD07100KL: RES SMD 100K OHM 0.1% 1/4W 1206; Manufacturer: Yageo; id: 6936; Temperature Coefficient: ±25ppm/°C; Power (Watts): 0.25W, 1/4W; Part Number: RT1206BRD07100KL; Height - Seated (Max): 0.026" (0.65mm); Supplier Part Number 1: YAG2003CT-ND; Supplier Device Package: 1206; ComponentLink1Description: Datasheet; ComponentLink2URL: https://www.digikey.com/en/products/detail/yageo/RT1206BRD07100KL/1079461; ComponentLink1URL: https://www.yageo.com/upload/media/product/productsearch/datasheet/rchip/PYu-RT_1-to-0.01_RoHS_L_11.pdf; Composition: Thin Film; Tolerance: ±0.1%; Supplier 1: DigiKey; Series: RT; Part Status: Active; ComponentLink2Description: DigiKey Link; Device Package: 1206 (3216 Metric); Packaging: TapeAndReel; Minimum Order: 1; Package / Case: 1206 (3216 Metric); PartId: 39875; Lifecycle Status: Active; LastUpdated: 2023-01-02T20:36:33.687; Operating Temperature: -55°C ~ 155°C; Number Of Terminations: 2; Value: 100 kOhms; Size / Dimension: 0.122" L x 0.063" W (3.10mm x 1.60mm); Price: 0.10; Resistance: 100 kOhms
U1D = CMP-04917-000172-1: IC REG LINEAR POS ADJ 1A 6WSON